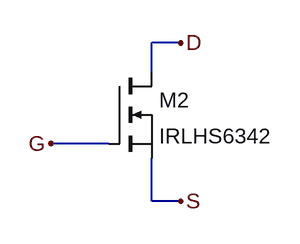
[diagram p0: schematic My_nMOS.asc]
My_nMOS.asc, the LTspice schematic file:
Version 4
SHEET 1 1040 680
WIRE 192 -96 160 -96
WIRE 160 -64 160 -96
WIRE 112 16 48 16
WIRE 160 80 160 32
WIRE 192 80 160 80
FLAG 192 -96 D
FLAG 192 80 S
FLAG 48 16 G
SYMBOL nmos 112 -64 R0
SYMATTR InstName M2
SYMATTR Value IRLHS6342

The netlist it stands for:
* My_nMOS.asc
M2 D G S S IRLHS6342
.model NMOS NMOS
.model PMOS PMOS
.lib standard.mos
.backanno
.end